# EAGLE design version1 (EAGLE 8.2.2)
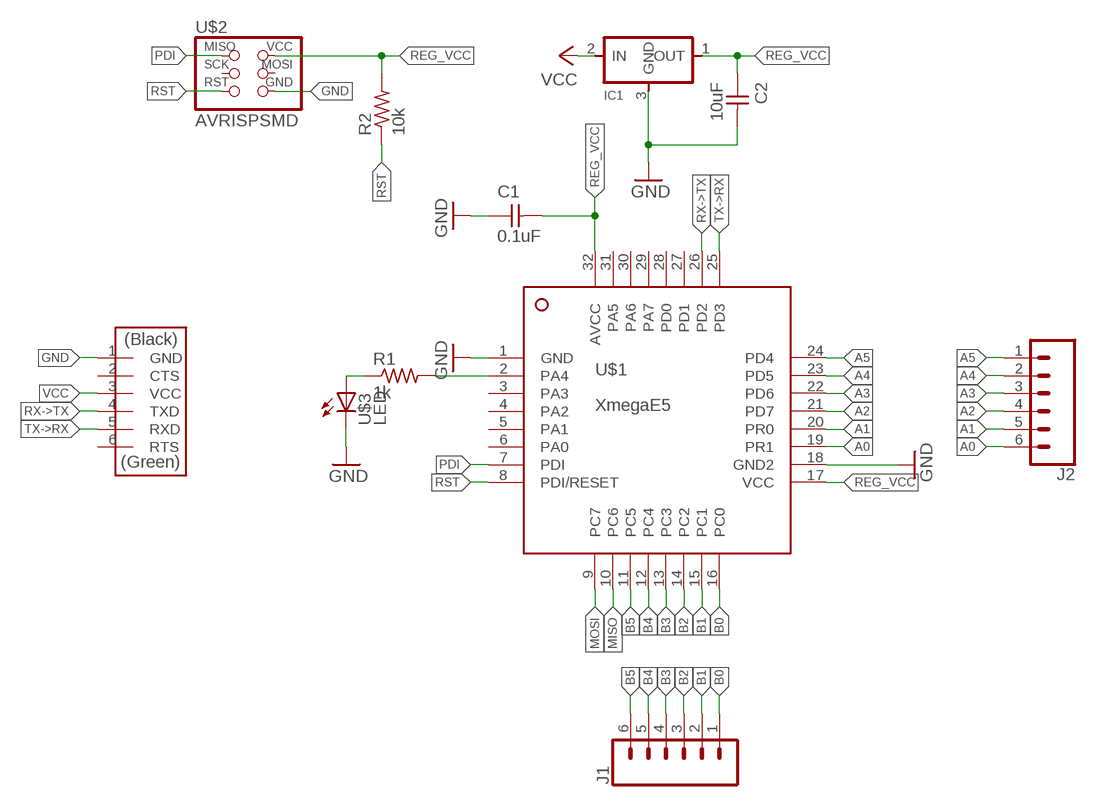
[diagram p0: schematic, sheet 1]

## Parts
C1  0.1uF  CAP-UNPOLARIZEDFAB  [C1206FAB]
C2  10uF  CAP-UNPOLARIZEDFAB  [C1206FAB]
IC1  REGULATORSOT23  [SOT23]
J1  CONN_06SMD_MALE  [1X06_SMD_MALE]
J2  CONN_06SMD_MALE  [1X06_SMD_MALE]
R1  1k  RES-US1206FAB  [R1206FAB]
R2  10k  RES-US1206FAB  [R1206FAB]
U$1  XmegaE5  ATXMEGA8E5-M4UTQFP  [QFP80P900X900X120-32N]
U$2  AVRISPSMD  [2X03SMD]
U$3  LED  LEDFAB1206  [LED1206FAB]
U$4  FTDI-SMD-HEADER  [1X06SMD]

## Nets
A0: J2.6 U$1.19(PR1)
A1: J2.5 U$1.20(PR0)
A2: J2.4 U$1.21(PD7)
A3: J2.3 U$1.22(PD6)
A4: J2.2 U$1.23(PD5)
A5: J2.1 U$1.24(PD4)
B0: J1.1 U$1.16(PC0)
B1: J1.2 U$1.15(PC1)
B2: J1.3 U$1.14(PC2)
B3: J1.4 U$1.13(PC3)
B4: J1.5 U$1.12(PC4)
B5: J1.6 U$1.11(PC5)
GND: C1.1 C2.2 IC1.3(GND) U$1.1(GND) U$1.18(GND2) U$2.6(GND) U$3.2(C) U$4.1(GND)
MISO: U$1.10(PC6)
MOSI: U$1.9(PC7)
N$1: R1.2 U$1.2(PA4)
N$2: R1.1 U$3.1(A)
PDI: U$1.7(PDI) U$2.1(MISO)
REG_VCC: C1.2 C2.1 IC1.1(OUT) R2.2 U$1.17(VCC) U$1.32(AVCC) U$2.2(VCC)
RST: R2.1 U$1.8(PDI/RESET) U$2.5(RST)
RX->TX: U$1.26(PD2) U$4.4(TXD)
TX->RX: U$1.25(PD3) U$4.5(RXD)
VCC: IC1.2(IN) U$4.3(VCC)
Unconnected: U$1.3(PA3) U$1.4(PA2) U$1.5(PA1) U$1.6(PA0) U$1.27(PD1) U$1.28(PD0) U$1.29(PA7) U$1.30(PA6) U$1.31(PA5) U$2.3(SCK) U$2.4(MOSI) U$4.2(CTS) U$4.6(RTS)

## Library data of the parts
C1 C2 = fab:CAP-UNPOLARIZED
IC1 = fab:REGULATOR
J1 J2 = SparkFun-Connectors:CONN_06: Multi connection point. Often used as Generic Header-pin footprint for 0.1 inch spaced/style header connections On any of the 0.1 inch spaced packages, you can populate with these: Break Away Headers - Straight <https://www.sparkfun.com/products/116> (PRT-00116) Break Away Male Headers - Right Angle <https://www.sparkfun.com/products/553> (PRT-00553) Female Headers <https://www.sparkfun.com/products/115> (PRT-00115) Break Away Headers - Machine Pin <https://www.sparkfun.com/products/117> (PRT-00117) Break Away Female Headers - Swiss Machine Pin <https://www.sparkfun.com/products/743> (PRT-00743) Arduino Stackable Header - 6 Pin <https://www.sparkfun.com/products/9280> (PRT-09280) For SCREWTERMINALS and SPRING TERMINALS visit here: Screw Terimnals on SparkFun.com <https://www.sparkfun.com/search/results?term=Screw+Terminals> (5mm/3.5mm/2.54mm spacing) This device is also useful as a general connection point to wire up your design to another part of your project. Our various solder wires solder well into these plated through hole pads. Hook-Up Wire - Assortment (Stranded, 22 AWG) <https://www.sparkfun.com/products/11375> (PRT-11375) Hook-Up Wire - Assortment (Solid Core, 22 AWG) <https://www.sparkfun.com/products/11367> (PRT-11367) View the entire wire category on our website here <https://www.sparkfun.com/categories/141>; PROD_ID: CONN-11293
R1 R2 = fab:RES-US: Resistor (US Symbol) Variants with postfix FAB are widened to allow the routing of internal traces
U$1 = _uControllers:ATXMEGA8E5-M4U: ATxmega8E5 Series 32 MHz 8 KB Flash 1 KB SRAM 8/16-Bit Microcontroller-UQFN-32
U$2 = fab:AVRISP
U$3 = fab:LED: LED
U$4 = fab:FTDI-SMD-HEADER

## Board
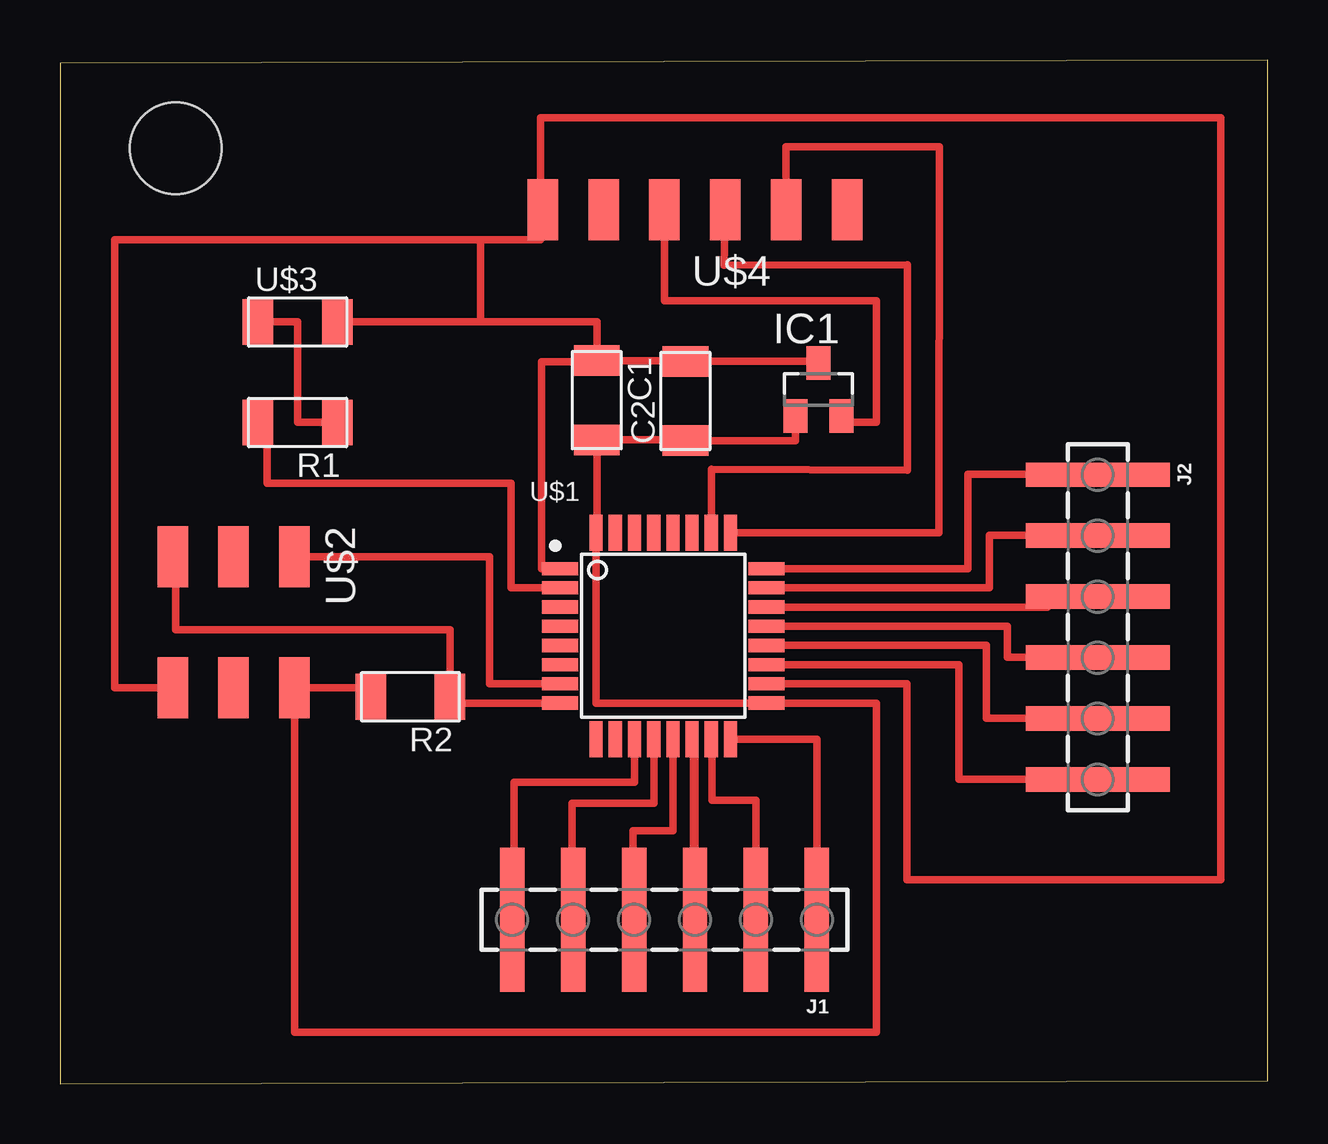
[diagram p1: board, top side]

Size 50.34 x 42.66 mm. Coordinates in mm from the lower left corner, seen from the top.
Outline: 0,0 50.34,0.13 50.34,42.66 0,42.53 0,0
Copper layers (1*16): Top 0.035mm / dielectric 1.5mm / Bottom 0.035mm
Design rules "OthermillDRC_30_deg_v2": minimum track width 6mil, minimum drill 0.8mm, track to track 6mil, track to pad 6mil, pad to pad 6mil, via to via 6mil, smd to smd 0mil, copper to edge 0mil, drill to drill 6mil, minimum pad ring 10mil, minimum via ring 10mil, stop-mask expansion 1mil, vias tented up to drill 30mil, thermal gap 6mil
Holes 3.81 mm at 4.83,38.99

### Footprints (pad centres in the part's own frame; a part is rotated, then mirrored left to right if it is on the bottom)
C1206FAB = smd 1.27 x 1.905: 1 -1.651,0; 2 1.651,0
SOT23 = smd 1 x 1.4: 1 -0.95,-1.1; 2 0.95,-1.1; 3 0,1.1
1X06_SMD_MALE = smd 1.02 x 6: 1 0,0; 2 2.54,0; 3 5.08,0; 4 7.62,0; 5 10.16,0; 6 12.7,0
R1206FAB = smd 1.27 x 1.905: 1 -1.651,0; 2 1.651,0
QFP80P900X900X120-32N = smd 1.5 x 0.55: 1 -4.3,2.8; 2 -4.3,2; 3 -4.3,1.2; 4 -4.3,0.4; 5 -4.3,-0.4; 6 -4.3,-1.2; 7 -4.3,-2; 8 -4.3,-2.8; 17 4.3,-2.8; 18 4.3,-2; 19 4.3,-1.2; 20 4.3,-0.4; 21 4.3,0.4; 22 4.3,1.2; 23 4.3,2; 24 4.3,2.8 | smd 0.55 x 1.5: 9 -2.8,-4.3; 10 -2,-4.3; 11 -1.2,-4.3; 12 -0.4,-4.3; 13 0.4,-4.3; 14 1.2,-4.3; 15 2,-4.3; 16 2.8,-4.3; 25 2.8,4.3; 26 2,4.3; 27 1.2,4.3; 28 0.4,4.3; 29 -0.4,4.3; 30 -1.2,4.3; 31 -2,4.3; 32 -2.8,4.3
2X03SMD = smd 2.54 x 1.27: 1 -2.54,2.54; 2 2.92,2.54; 3 -2.54,0; 4 2.92,0; 5 -2.54,-2.54; 6 2.92,-2.54
LED1206FAB = smd 1.27 x 1.905: 1 -1.651,0; 2 1.651,0
1X06SMD = smd 2.54 x 1.27: 1 0,6.35; 2 0,3.81; 3 0,1.27; 4 0,-1.27; 5 0,-3.81; 6 0,-6.35

### Placement (x,y rotation side)
C1  22.38,28.49 270 top
C2  26.07,28.45 90 top
IC1  31.61,28.94 0 top
J1  31.55,6.84 180 top
J2  43.25,25.38 270 top
R1  9.91,27.56 180 top
R2  14.61,16.13 180 top
U$1  25.15,18.67 0 top
U$2  7.24,19.43 270 top
U$3  9.91,31.75 0 top
U$4  26.47,36.42 90 top

### Tracks (layer width: path | path; a pad name or v marks a point on that pad's centre or on a via)
A0
  Top 0.305: U$1.19 37.46,17.47 37.46,12.7 43.25,12.7 J2.6
A1
  Top 0.305: U$1.20 38.61,18.27 38.61,15.24 43.25,15.24 J2.5
A2
  Top 0.305: U$1.21 39.5,19.07 39.5,17.78 43.25,17.78 J2.4
A3
  Top 0.305: U$1.22 41.15,19.87 41.15,20.32 43.25,20.32 J2.3
A4
  Top 0.305: U$1.23 38.73,20.67 38.73,22.86 42.23,22.86 J2.2
A5
  Top 0.305: U$1.24 37.85,21.47 37.85,25.4 42.23,25.4 J2.1
B0
  Top 0.305: U$1.16 31.55,14.37 J1.1
B1
  Top 0.305: U$1.15 27.18,14.37 27.18,11.81 29.01,11.81 J1.2
B2
  Top 0.305: 26.42,8.51 26.42,14.37 U$1.14 26.47,14.37 J1.3
B3
  Top 0.305: J1.4 23.88,6.84 23.88,10.54 25.55,10.54 U$1.13
B4
  Top 0.305: U$1.12 24.77,14.37 24.77,11.68 21.34,11.68 21.34,10.04 | 21.34,10.04 21.34,8.38 | J1.5 21.34,6.84 21.34,10.04
B5
  Top 0.305: J1.6 18.92,6.84 18.92,12.57 23.95,12.57 U$1.11
GND
  Top 0.305: C1.1 26.04,30.14 C2.2 31.61,30.1 IC1.3 | C1.1 22.38,30.1 20.07,30.1 20.07,21.47 U$1.1 | U$3.2 17.53,31.75 | 17.53,35.18 17.53,31.75 | 20.02,35.18 17.53,35.18 | 20.02,35.18 U$4.1 | 17.53,31.75 22.38,31.75 C1.1 | U$2.6 2.29,16.51 2.29,35.18 17.53,35.18 | U$1.18 35.31,16.67 35.31,8.51 48.39,8.51 48.39,40.26 20.02,40.26 20.02,35.18
N$1
  Top 0.305: R1.2 8.64,27.56 8.64,25.1 | 8.64,25.1 8.64,25.02 | U$1.2 18.8,20.67 18.8,25.02 8.64,25.02 | 8.64,25.02 8.64,25.1
N$2
  Top 0.305: U$3.1 9.91,31.75 9.91,27.56 R1.1
PDI
  Top 0.305: U$1.7 17.91,16.67 17.91,21.97 U$2.1
REG_VCC
  Top 0.152: U$1.32 22.38,23
  Top 0.305: 22.38,23 C1.2 26.04,26.84 C2.1 30.66,26.8 IC1.1 | R2.2 13.34,16.51 U$2.2 9.78,2.16 34.04,2.16 34.04,15.87 U$1.17 22.35,15.87 U$1.32
RST
  Top 0.305: 20.85,15.75 U$1.8 16.64,15.87 R2.1 16.26,18.92 4.83,18.92 4.83,21.97 U$2.5
RX->TX
  Top 0.152: U$1.26
  Top 0.305: U$1.26 27.15,25.6 35.33,25.58 35.33,34.14 27.69,34.11 U$4.4
TX->RX
  Top 0.152: 28.02,22.97 U$1.25
  Top 0.305: U$4.5 30.25,39.04 36.65,39.04 36.63,22.97 U$1.25
VCC
  Top 0.305: IC1.2 32.56,27.56 34.04,27.56 34.04,32.64 25.2,32.64 U$4.3